# Altium schematic sheet ADC_Decoupling.SchDoc
size A4; DocumentNumber: 8; SheetNumber: 8; SheetTotal: 8
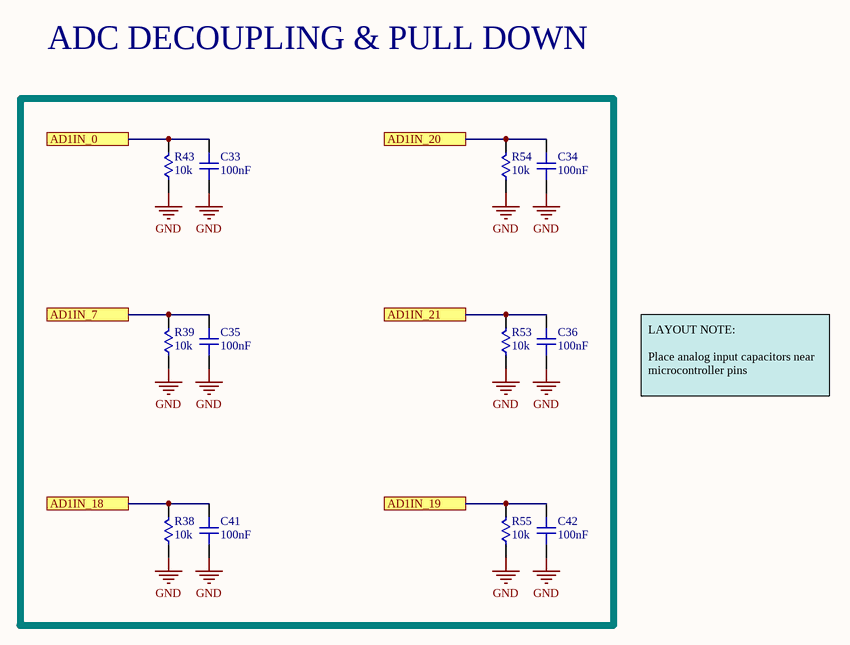
[diagram p0: ADC_Decoupling.SchDoc]

## Parts
C33  100nF  [C0402]
C34  100nF  [C0402]
C35  100nF  [C0402]
C36  100nF  [C0402]
C41  100nF  [C0402]
C42  100nF  [C0402]
R38  10k  [R0402]
R39  10k  [R0402]
R43  10k  [R0402]
R53  10k  [R0402]
R54  10k  [R0402]
R55  10k  [R0402]

## Ports
AD1IN_0, AD1IN_7, AD1IN_18, AD1IN_19, AD1IN_20, AD1IN_21

## Nets
GND: C33.1 C34.1 C35.1 C36.1 C41.1 C42.1 R38.1 R39.1 R43.1 R53.1 R54.1 R55.1
AD1IN_0: C33.2 R43.2 ; port AD1IN_0
AD1IN_7: C35.2 R39.2 ; port AD1IN_7
AD1IN_18: C41.2 R38.2 ; port AD1IN_18
AD1IN_19: C42.2 R55.2 ; port AD1IN_19
AD1IN_20: C34.2 R54.2 ; port AD1IN_20
AD1IN_21: C36.2 R53.2 ; port AD1IN_21

## Notes on the sheet
- ADC DECOUPLING & PULL DOWN
- LAYOUT NOTE:
  Place analog input capacitors near microcontroller pins

## Library data of the parts
C33-C36 C41 C42 = CL05A104MP5NNNC: CAP MLCC 0.1uF 10V X5R 0402 20% SMD 0402 85C Paper T/R; Manufacturer: Samsung; Supplier 1: Digi-Key; Manufacturer Part Number: CL05A104MP5NNNC; Stock 1: 100000; Pricing 1: 1=0.1, 10=0.024, 100=0.0106, 500=0.0076, 1000=0.006, 2500=0.0054, 5000=0.005 (USD); Mount: Surface Mount; Case/Package: 0402; Case Code (Metric): 1005; Case Code (Imperial): 0402; Min Operating Temperature: -55°C; Max Operating Temperature: 85°C; Packaging: Tape and Reel; Capacitance: 100nF; Tolerance: 20%; Voltage Rating: 10V; Dielectric: X5R; Voltage Rating (DC): 10V; Length: 1mm; Height: 0.5mm; Width: 0.02inch; Thickness: 0.022inch; Depth: 0.5mm; Radiation Hardening: No; Lead Free: Lead Free; ComponentLink1URL: https://media.digikey.com/pdf/Data%20Sheets/Samsung%20PDFs/CL_Series_MLCC_ds.pdf; ComponentLink1Description: https://media.digikey.com/pdf/Data%20Sheets/Samsung%20PDFs/CL_Series_MLCC_ds.pdf; Supplier Part Number 1: 1276-1443-1-ND
R38 R39 R43 R53-R55 = RC0402JR-0710KL: RES SMD 10K OHM 5% 1/16W 0402; Manufacturer: Yageo; Resistance: 10kR; Power Rating: 62.5mW; Voltage Rating: 50V; Temperature Coefficient: 100ppm/°C; Max Power Dissipation: 63mW; Supplier 1: Digi-Key; Manufacturer Part Number: RC0402JR-0710KL; Stock 1: 47303622; Pricing 1: 1=0.1, 10=0.018, 100=0.0073, 1000=0.0033, 2500=0.0029, 5000=0.0024 (USD); Case/Package: 0402; Case Code (Metric): 1005; Case Code (Imperial): 0402; Min Operating Temperature: -55°C; Max Operating Temperature: 155°C; Packaging: Tape and Reel; Tolerance: 5%; Package Quantity: 1; Composition: Thick Film; Number of Terminations: 2; Termination: SMD/SMT; Military Standard: Not; Features: Moisture Resistant; Length: 1mm; Height: 0.016inch; Width: 0.02inch; Depth: 0.5mm; REACH SVHC: Unknown; Lead Free: Lead Free; Supplier Part Number 1: 311-10KJRCT-ND